# EasyEDA schematic SCH_Ducky.json
TITLE: Sheet_1; REV: 1.0; Date: 2024-01-14; Sheet: 1/1; Drawn By: neeravgupta07; Company: Your Company
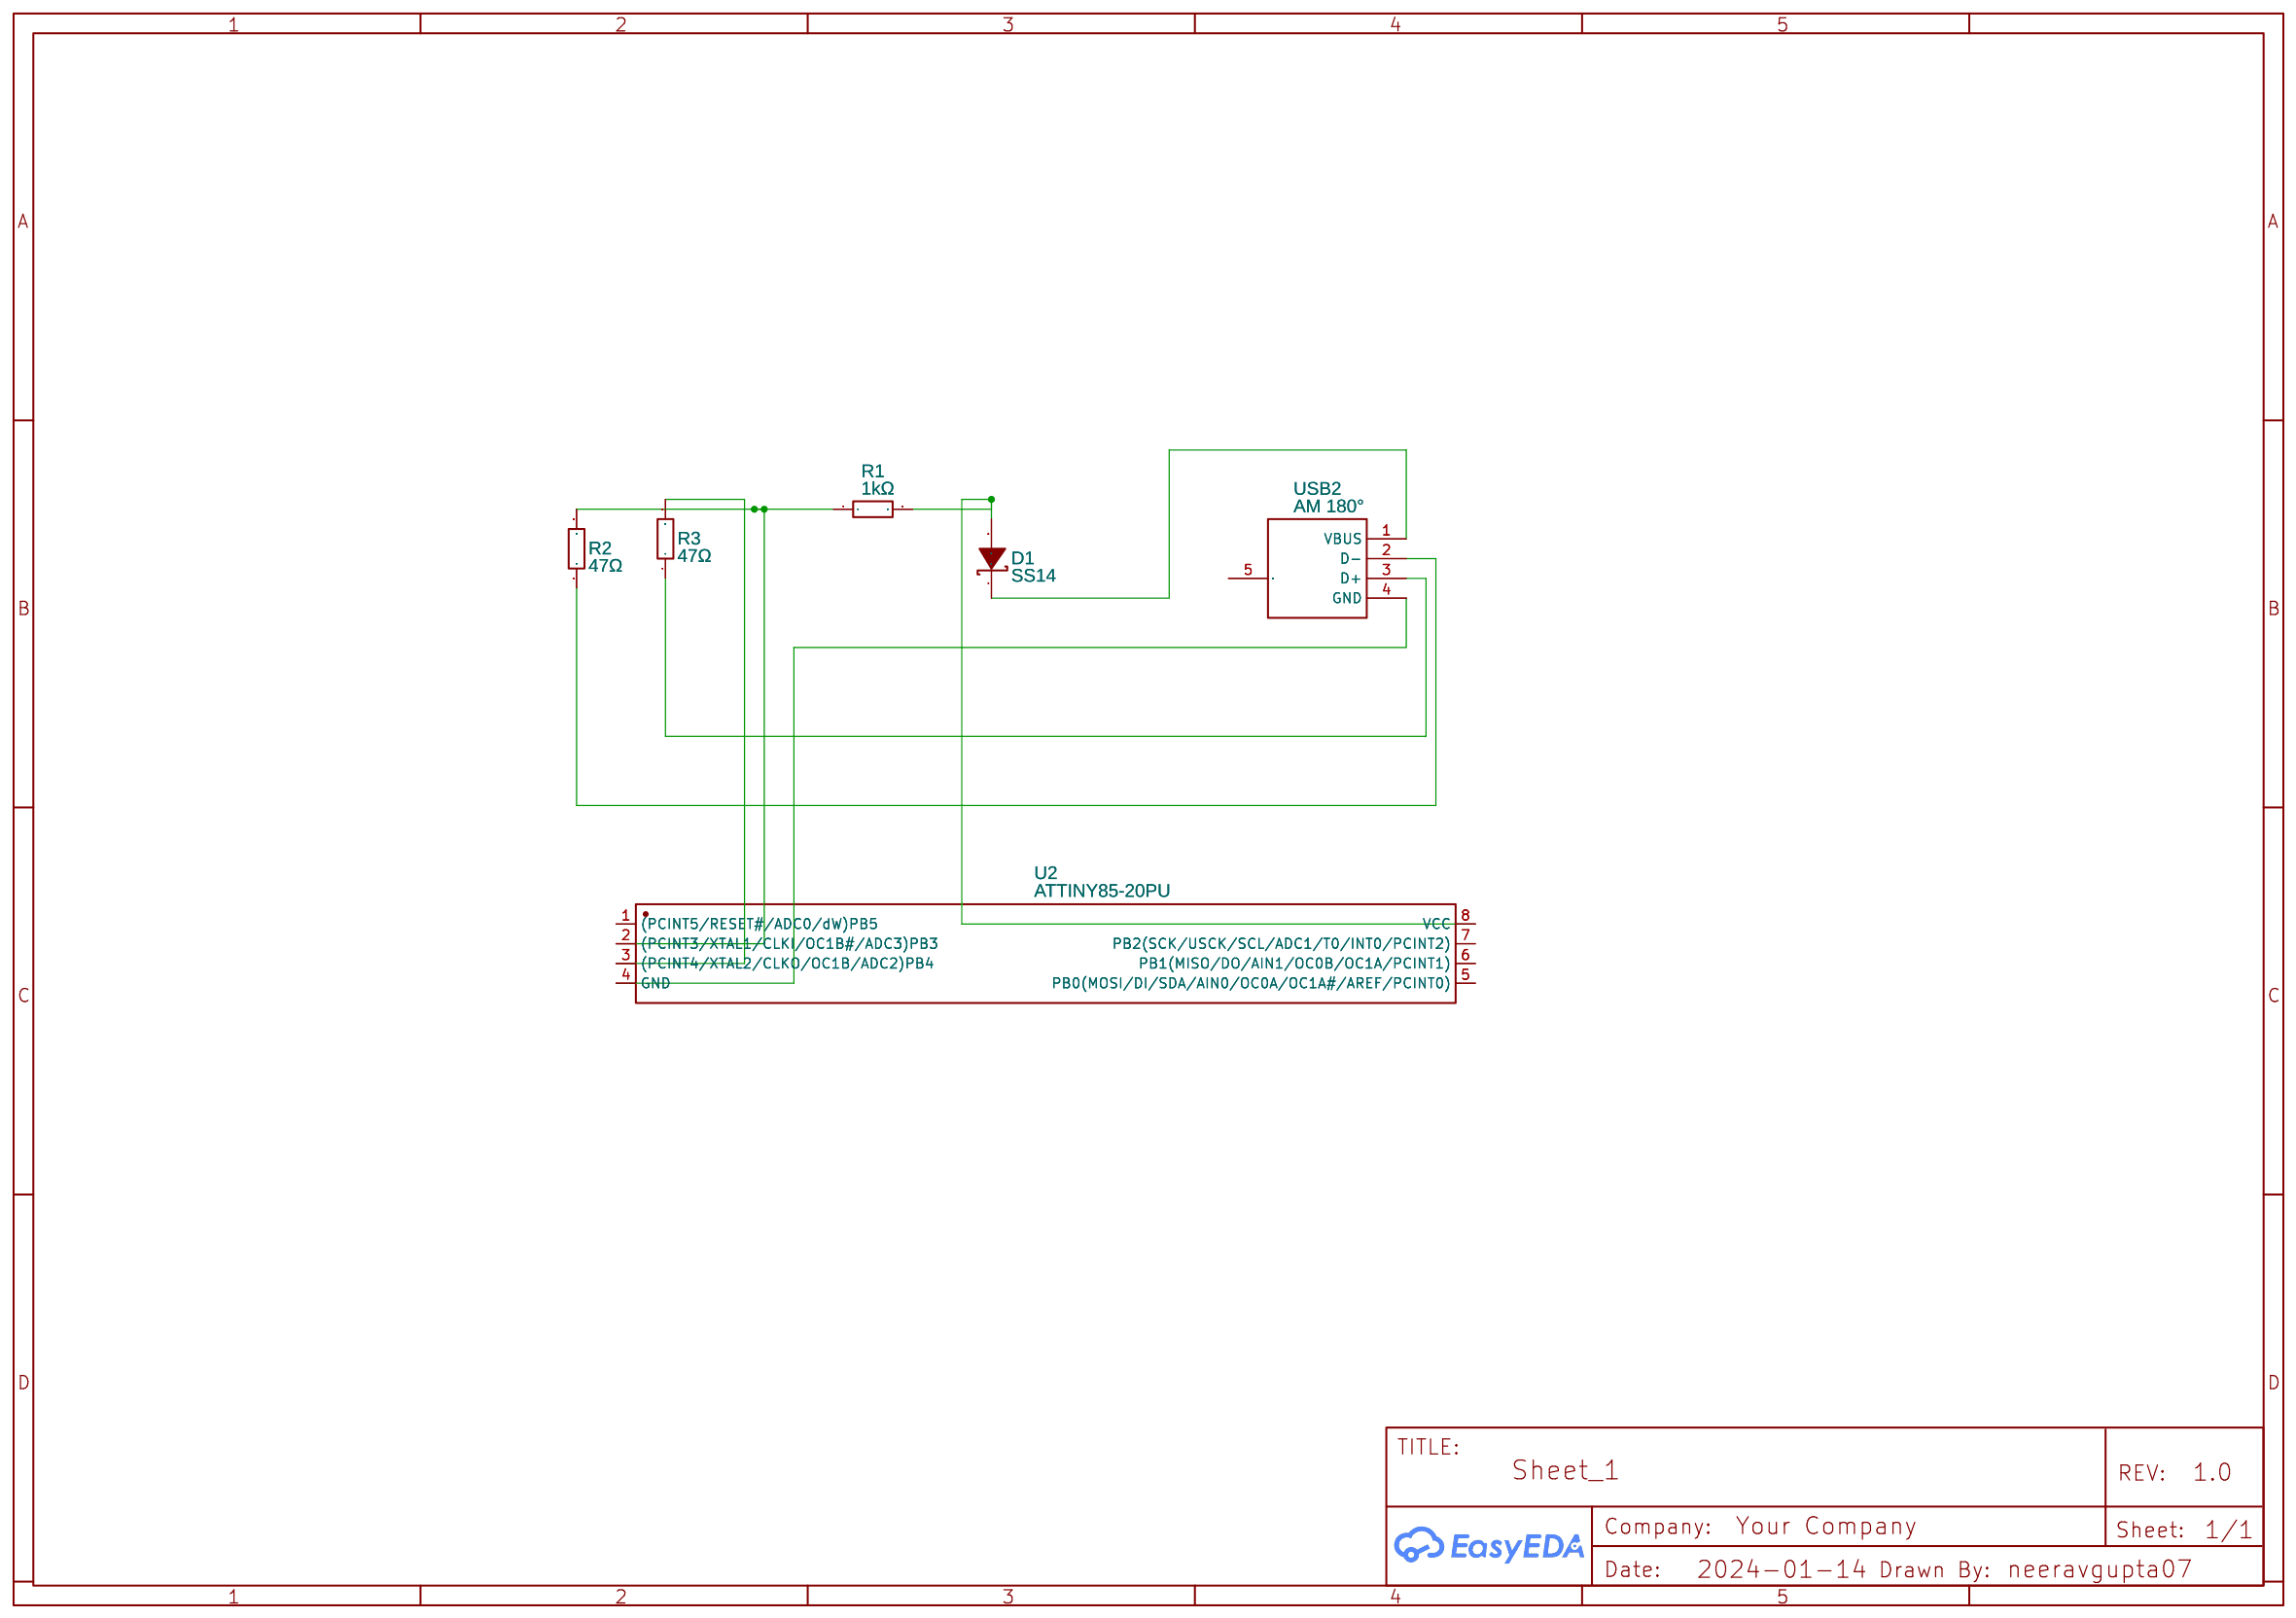
[diagram p0: schematic sheet]

## Parts
D1  SS14  [SMA_L4.2-W2.6-LS5.3-RD]
R1  1kΩ  [R0603]
R2  47Ω  [R0603]
R3  47Ω  [R0603]
U2  ATTINY85-20PU  [PDIP-8_L9.3-W6.4-P2.54-LS7.9-BL-1]
USB2  AM 180°  [USB-SMD_AM180]

## Library data of the parts
D1 = SS14: Supplier: LCSC; Manufacturer: MDD; Supplier Part: C2480; JLCPCB Part Class: Basic Part
R1 = 0603WAF1001T5E: Supplier: LCSC; Manufacturer: UNI-ROYAL(厚声); Supplier Part: C21190; JLCPCB Part Class: Basic Part
R2 R3 = 0603WAF470JT5E: Supplier: LCSC; Manufacturer: UNI-ROYAL(厚声); Supplier Part: C23182; JLCPCB Part Class: Basic Part
U2 = ATTINY85-20PU: Contributor: LCSC; Supplier: LCSC; Supplier Part: C965497; Manufacturer: MICROCHIP(美国微芯); JLCPCB Part Class: Extended Part
USB2 = AM 180°: Contributor: LCSC; Supplier: LCSC; Supplier Part: C2681564; Manufacturer: SHOU HAN(首韩); JLCPCB Part Class: Extended Part

## Nets
Net-(D1-1): D1.1(K) USB2.1(VBUS)
Net-(D1-2): D1.2(A) R1.2 U2.8(VCC)
Net-(R1-1): R1.1 R2.2 U2.2((PCINT3/XTAL1/CLKI/OC1B#/ADC3)PB3)
Net-(R2-1): R2.1 USB2.2(D-)
Net-(R3-1): R3.1 USB2.3(D+)
Net-(R3-2): R3.2 U2.3((PCINT4/XTAL2/CLKO/OC1B/ADC2)PB4)
Net-(U2-4): U2.4(GND) USB2.4(GND)

Not connected (* = marked no-connect by the designer): U2 1((PCINT5/RESET#/ADC0/dW)PB5) 5(PB0(MOSI/DI/SDA/AIN0/OC0A/OC1A#/AREF/PCINT0)) 6(PB1(MISO/DO/AIN1/OC0B/OC1A/PCINT1)) 7(PB2(SCK/USCK/SCL/ADC1/T0/INT0/PCINT2)); USB2 5(EH)
